# EAGLE design Voltage_Logger (EAGLE 6.4)
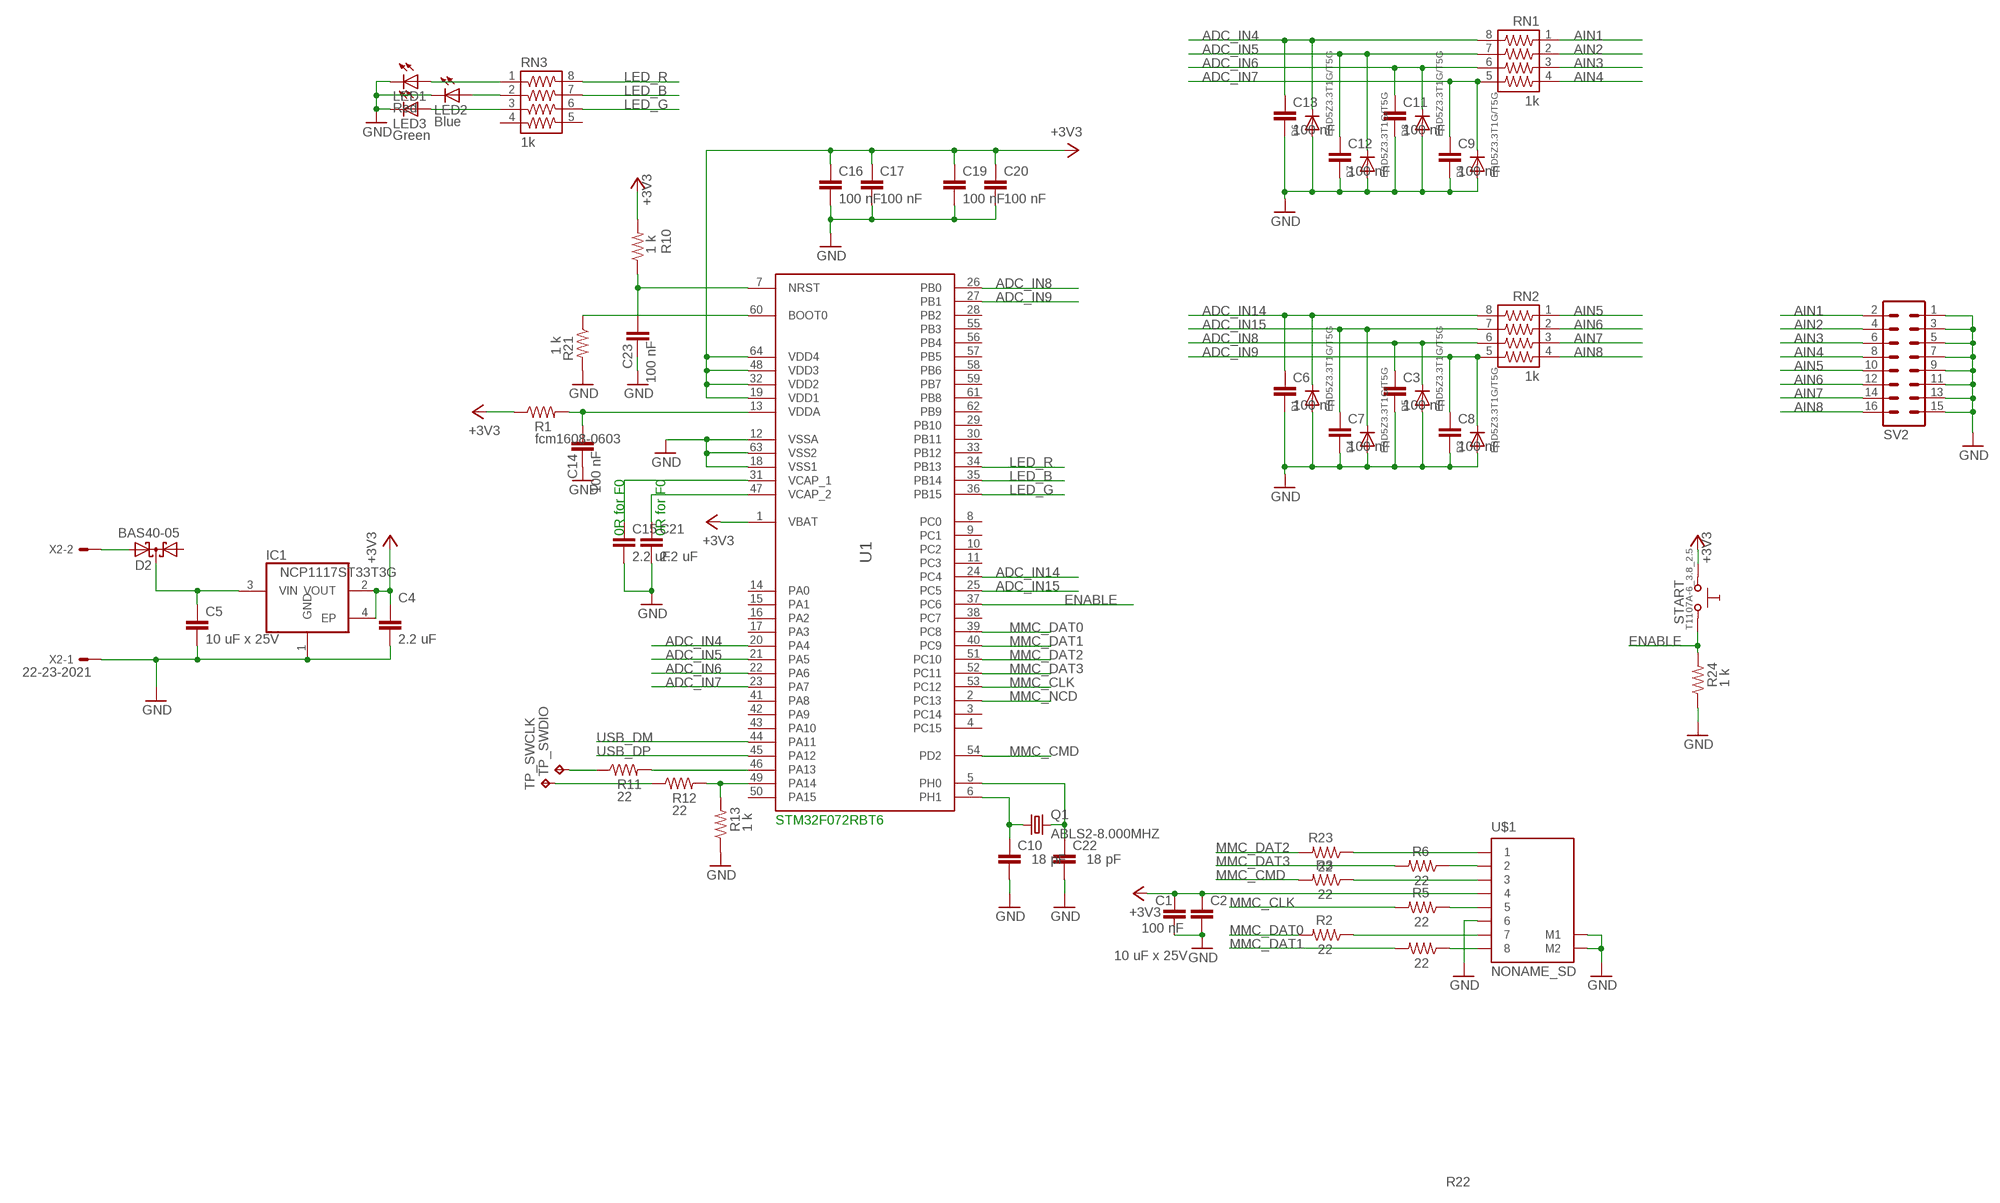
[diagram p0: schematic, sheet 1]

## Parts
C1  100 nF  C-EUC0603  [C0603]
C2  10 uF x 25V  C-EUC1206  [C1206]
C3  100 nF  C-EUC0603  [C0603]
C4  2.2 uF  C-EUC0603  [C0603]
C5  10 uF x 25V  C-EUC1206  [C1206]
C6  100 nF  C-EUC0603  [C0603]
C7  100 nF  C-EUC0603  [C0603]
C8  100 nF  C-EUC0603  [C0603]
C9  100 nF  C-EUC0603  [C0603]
C10  18 pF  C-EUC0603  [C0603]
C11  100 nF  C-EUC0603  [C0603]
C12  100 nF  C-EUC0603  [C0603]
C13  100 nF  C-EUC0603  [C0603]
C14  100 nF  C-EUC0603  [C0603]
C15  2.2 uF  C-EUC0603  [C0603]
C16  100 nF  C-EUC0603  [C0603]
C17  100 nF  C-EUC0603  [C0603]
C19  100 nF  C-EUC0603  [C0603]
C20  100 nF  C-EUC0603  [C0603]
C21  2.2 uF  C-EUC0603  [C0603]
C22  18 pF  C-EUC0603  [C0603]
C23  100 nF  C-EUC0603  [C0603]
D1  ESD5Z3.3T1G/T5G  DIODESOD-523  [SOD-523]
D2  BAS40-05  [SOT23]
D3  ESD5Z3.3T1G/T5G  DIODESOD-523  [SOD-523]
D4  ESD5Z3.3T1G/T5G  DIODESOD-523  [SOD-523]
D5  ESD5Z3.3T1G/T5G  DIODESOD-523  [SOD-523]
D6  ESD5Z3.3T1G/T5G  DIODESOD-523  [SOD-523]
D7  ESD5Z3.3T1G/T5G  DIODESOD-523  [SOD-523]
D8  ESD5Z3.3T1G/T5G  DIODESOD-523  [SOD-523]
D9  ESD5Z3.3T1G/T5G  DIODESOD-523  [SOD-523]
IC1  NCP1117ST33T3G  REG1117  [SOT223]
LED1  Red  LED_ESML0603  [LED_SML0603]
LED2  Blue  LED_ESML0603  [LED_SML0603]
LED3  Green  LED_ESML0603  [LED_SML0603]
Q1  ABLS2-8.000MHZ  CRYSTALSM49  [SM49]
R1  fcm1608-0603  R-US_R0603  [R0603]
R2  22  R-US_R0603  [R0603]
R3  22  R-US_R0603  [R0603]
R5  22  R-US_R0603  [R0603]
R6  22  R-US_R0603  [R0603]
R10  1 k  R-US_R0603  [R0603]
R11  22  R-US_R0603  [R0603]
R12  22  R-US_R0603  [R0603]
R13  1 k  R-US_R0603  [R0603]
R21  1 k  R-US_R0603  [R0603]
R22  22  R-US_R0603  [R0603]
R23  22  R-US_R0603  [R0603]
R24  1 k  R-US_R0603  [R0603]
RN1  1k  742-8NS  [742-8NS]
RN2  1k  742-8NS  [742-8NS]
RN3  1k  742-8NS  [742-8NS]
START  T1107A-6_3.8_2.5  SW-TAKT6  [SW-TAKT_6X3.5_SMD]
SV2  MA08-2  [MA08-2]
TP_SWCLK  TPTP10SQ  [TP10SQ]
TP_SWDIO  TPTP10SQ  [TP10SQ]
U1  STM32F405RGT6  STM32F405XXSTM32F405XX  [LQFP64]
U$1  NONAME_SD  [NONAME_SD]
X2  22-23-2021  [22-23-2021]

## Nets
+3V3: C1.1 C2.1 C4.1 C16.1 C17.1 C19.1 C20.1 IC1.2(VOUT) IC1.4(EP) R1.1 R10.2 START.P$1 U1.1(VBAT) U1.19(VDD1) U1.32(VDD2) U1.48(VDD3) U1.64(VDD4) U$1.4
ADC_IN4: C13.1 D6.K(C) RN1.8 U1.20(PA4)
ADC_IN5: C12.1 D7.K(C) RN1.7 U1.21(PA5)
ADC_IN6: C11.1 D8.K(C) RN1.6 U1.22(PA6)
ADC_IN7: C9.1 D9.K(C) RN1.5 U1.23(PA7)
ADC_IN8: C3.1 D5.K(C) RN2.6 U1.26(PB0)
ADC_IN9: C8.1 D3.K(C) RN2.5 U1.27(PB1)
ADC_IN14: C6.1 D1.K(C) RN2.8 U1.24(PC4)
ADC_IN15: C7.1 D4.K(C) RN2.7 U1.25(PC5)
AIN1: RN1.1 SV2.2
AIN2: RN1.2 SV2.4
AIN3: RN1.3 SV2.6
AIN4: RN1.4 SV2.8
AIN5: RN2.1 SV2.10
AIN6: RN2.2 SV2.12
AIN7: RN2.3 SV2.14
AIN8: RN2.4 SV2.16
ENABLE: R24.2 START.P$2 U1.37(PC6)
GND: C1.2 C2.2 C3.2 C4.2 C5.2 C6.2 C7.2 C8.2 C9.2 C10.2 C11.2 C12.2 C13.2 C14.2 C15.2 C16.2 C17.2 C19.2 C20.2 C21.2 C22.2 C23.2 D1.A D3.A D4.A D5.A D6.A D7.A D8.A D9.A IC1.1(GND) LED1.C LED2.C LED3.C R13.1 R21.2 R24.1 SV2.1 SV2.3 SV2.5 SV2.7 SV2.9 SV2.11 SV2.13 SV2.15 U1.12(VSSA) U1.18(VSS1) U1.63(VSS2) U$1.6 U$1.M1 U$1.M2 X2.1
LED_B: RN3.7 U1.35(PB14)
LED_G: RN3.6 U1.36(PB15)
LED_R: RN3.8 U1.34(PB13)
MMC_CLK: R5.2 U1.53(PC12)
MMC_CMD: R3.2 U1.54(PD2)
MMC_DAT0: R2.2 U1.39(PC8)
MMC_DAT1: R22.2 U1.40(PC9)
MMC_DAT2: R23.2 U1.51(PC10)
MMC_DAT3: R6.2 U1.52(PC11)
MMC_NCD: U1.2(PC13)
N$1: C15.1 U1.31(VCAP_1)
N$2: D2.2(A2) X2.2
N$3: C14.1 R1.2 U1.13(VDDA)
N$4: R3.1 U$1.3
N$5: R2.1 U$1.7
N$6: R5.1 U$1.5
N$7: LED2.A RN3.2
N$9: C5.1 D2.3(C) IC1.3(VIN)
N$11: R6.1 U$1.2
N$16: LED1.A RN3.1
N$18: LED3.A RN3.3
N$19: R22.1 U$1.8
N$20: R23.1 U$1.1
N$21: R11.2 U1.46(PA13)
N$22: R12.2 R13.2 U1.49(PA14)
N$23: C21.1 U1.47(VCAP_2)
N$24: R11.1 TP_SWDIO.TP
N$25: R12.1 TP_SWCLK.TP
N$27: C23.1 R10.1 U1.7(NRST)
N$28: R21.1 U1.60(BOOT0)
N$34: C22.1 Q1.2 U1.5(PH0)
N$35: C10.1 Q1.1 U1.6(PH1)
USB_DM: U1.44(PA11)
USB_DP: U1.45(PA12)
Unconnected: D2.1(A1) RN3.4 RN3.5 U1.3(PC14) U1.4(PC15) U1.8(PC0) U1.9(PC1) U1.10(PC2) U1.11(PC3) U1.14(PA0) U1.15(PA1) U1.16(PA2) U1.17(PA3) U1.28(PB2) U1.29(PB10) U1.30(PB11) U1.33(PB12) U1.38(PC7) U1.41(PA8) U1.42(PA9) U1.43(PA10) U1.50(PA15) U1.55(PB3) U1.56(PB4) U1.57(PB5) U1.58(PB6) U1.59(PB7) U1.61(PB8) U1.62(PB9)

## Notes on the sheet
- 0R for F0 | 0R for F0
- STM32F072RBT6

## Library data of the parts
C1-C17 C19-C23 = rcl:C-EU: CAPACITOR, European symbol
D1 D3-D9 = microbuilder:DIODE: Diode SMA Model Volts Amps Type Vf Vr Digikey # Notes SSA34-E3 40V 3A Schottky 480mV @ 3A 200uA @ 40V SSA34-E3/61TGITR-ND CDBA120-G 20V 1A Schottky 500mV @ 1A 500uA @ 20V 641-1014-6-ND REEL MBRA210 10V 2A Schottky 350mV @ 2A 700uA @ 10V MBRA210LT3 SOD-123 Model Volts Amps Type Vf Vr Order # Notes BAT54T1G 30V 200mA Schottky 800mV @ 200mA 2uA @ 25V BAT54T1GOSTR-ND B0530W 30V 500mA Schottky 430mV @ 500mA 130uA @ 30V B0530W-FDICT-ND REEL MBR120 1A 20V Schottky 340mV @ 1A MBR120VLSFT1GOSCT-ND SOD-323 Model Volts Amps Type Vf Vr Order # Notes PMEG2005EJ 20V 500mA Schottky 355mV @ 500mA 568-4110-1-ND ZLLS410 10V 570mA Schottky 380mV @ 570mA ZLLS410CT-ND 1N4148WS 75V 150mA Silicon/Simple 1V 1N4148WSFSCT-ND REEL SOD-523 Model Volts Amps Type Vf Vr Order # Notes BAT54XV2 30V 200mA Schottky 0.8V @ 100mA BAT54XV2CT-ND TB751S 30V 30mA Schottky RB751S-40TE61CT-ND SOT23-R/W (R = Solder Paste/Reflow Ovens, W = Hand-Soldering) Model Volts Amps Type Vf Vr Order # Notes BAT54FILM 40V 300mA Schottky 497-7162-1-ND
D2 = diode:BAS40-05: Silicon Schottky Diodes General-purpose diode for high-speed switching
IC1 = burr-brown:REG1117: 800mA and 1A Low Dropout (LDO) Positive Regulator 1.8V, 2.5V, 2.85V, 3.3V, 5V, and Adj; MPN: REG1117; OC_FARNELL: 1097566; OC_NEWARK: 14P6981
LED1-LED3 = eagle-ltspice:LED_E: LED Source: http://www.osram.convergy.de Source: www.luxeon.com Source: www.kingbright.com; SPICEMODEL: NONE; SPICEPREFIX: D; SPICETYPE: diode
Q1 = adafruit:CRYSTAL: CRYSTAL; OC_FARNELL: unknown; OC_NEWARK: unknown
R1-R3 R5 R6 R10-R13 R21-R24 = resistor:R-US_: RESISTOR, American symbol
RN1-RN3 = resistor-array:742-8: CTS 742 Series 8 Terminations, 4 Resistors
START = gogo:SW-TAKT
SV2 = con-lstb:MA08-2: PIN HEADER; OC_FARNELL: unknown; OC_NEWARK: unknown
TP_SWCLK TP_SWDIO = testpad:TP: Test pad
U1 = stm32f:STM32F405XX: Features • Core: ARM 32-bit Cortex™-M4 CPU with FPU, Adaptive real-time accelerator (ART Accelerator™) allowing 0-wait state execution from Flash memory, frequency up to 168 MHz, memory protection unit, 210 DMIPS/ 1.25 DMIPS/MHz (Dhrystone 2.1), and DSP instructions • Memories – Up to 1 Mbyte of Flash memory – Up to 192+4 Kbytes of SRAM including 64- Kbyte of CCM (core coupled memory) data RAM – Flexible static memory controller supporting Compact Flash, SRAM, PSRAM, NOR and NAND memories • LCD parallel interface, 8080/6800 modes • Clock, reset and supply management – 1.8 V to 3.6 V application supply and I/Os – POR, PDR, PVD and BOR – 4-to-26 MHz crystal oscillator – Internal 16 MHz factory-trimmed RC (1% accuracy) – 32 kHz oscillator for RTC with calibration – Internal 32 kHz RC with calibration • Low power – Sleep, Stop and Standby modes – VBAT supply for RTC, 20×32 bit backup registers + optional 4 KB backup SRAM • 3×12-bit, 2.4 MSPS A/D converters: up to 24 channels and 7.2 MSPS in triple interleaved mode • 2×12-bit D/A converters • General-purpose DMA: 16-stream DMA controller with FIFOs and burst support • Up to 17 timers: up to twelve 16-bit and two 32- bit timers up to 168 MHz, each with up to 4 IC/OC/PWM or pulse counter and quadrature (incremental) encoder input • Debug mode – Serial wire debug (SWD) & JTAG interfaces – Cortex-M4 Embedded Trace Macrocell™ • Up to 140 I/O ports with interrupt capability – Up to 136 fast I/Os up to 84 MHz – Up to 138 5 V-tolerant I/Os • Up to 15 communication interfaces – Up to 3 × I2C interfaces (SMBus/PMBus) – Up to 4 USARTs/2 UARTs (10.5 Mbit/s, ISO 7816 interface, LIN, IrDA, modem control) – Up to 3 SPIs (42 Mbits/s), 2 with muxed full-duplex I2S to achieve audio class accuracy via internal audio PLL or external clock – 2 × CAN interfaces (2.0B Active) – SDIO interface • Advanced connectivity – USB 2.0 full-speed device/host/OTG controller with on-chip PHY – USB 2.0 high-speed/full-speed device/host/OTG controller with dedicated DMA, on-chip full-speed PHY and ULPI – 10/100 Ethernet MAC with dedicated DMA: supports IEEE 1588v2 hardware, MII/RMII • 8- to 14-bit parallel camera interface up to 54 Mbytes/s • True random number generator • CRC calculation unit • 96-bit unique ID • RTC: subsecond accuracy, hardware calendar
U$1 = uSD:NONAME_SD
X2 = con-molex:22-23-2021: .100" (2.54mm) Center Header - 2 Pin; MF: MOLEX; MPN: 22-23-2021; OC_FARNELL: 1462926; OC_NEWARK: 25C3832

## Net classes
1 PWR: width 0.203 mm, drill 0.4 mm, clearance 0.076 mm

## Board
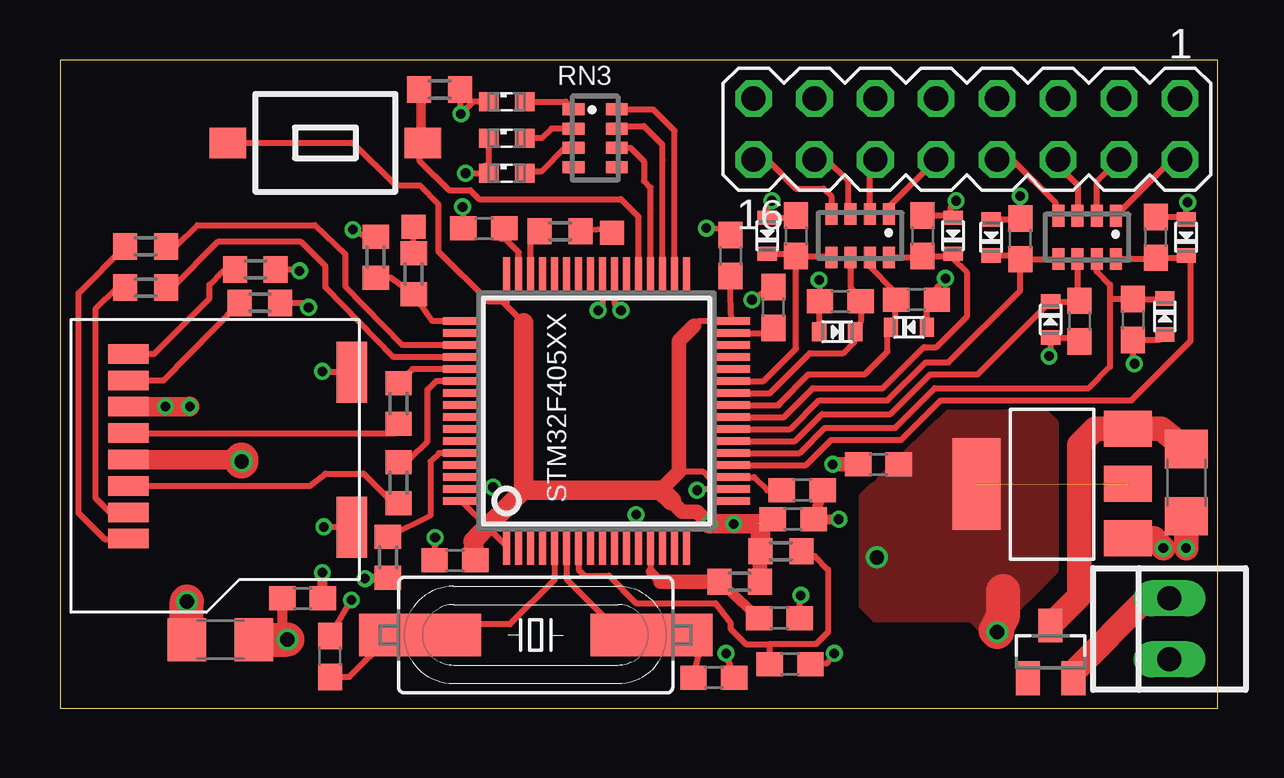
[diagram p1: board, top side]
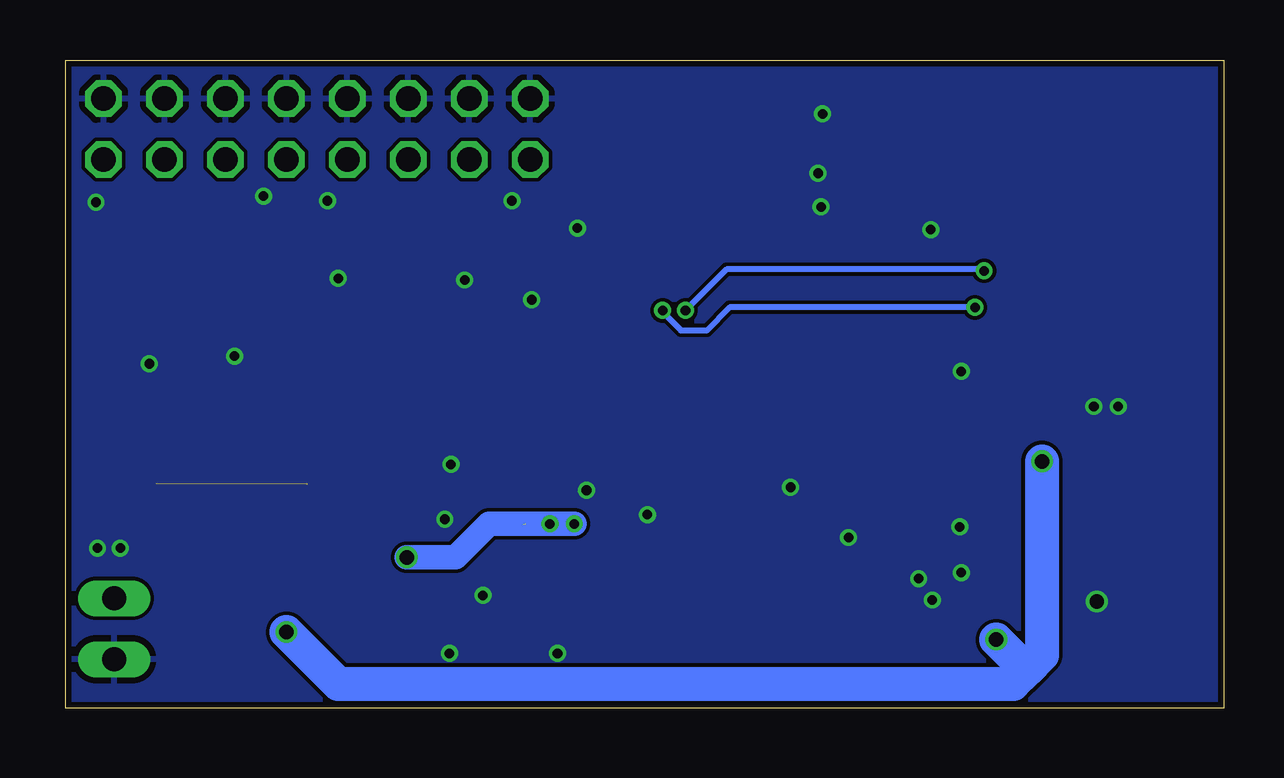
[diagram p2: board, bottom side, seen from below]

Size 48.26 x 27.01 mm. Coordinates in mm from the lower left corner, seen from the top.
Outline: 0,0 48.26,0 48.26,27.01 0,27.01 0,0
Copper layers (1*16): Top 0.035mm / dielectric 1.5mm / Bottom 0.035mm
Design rules "dirt_cheap_dirty_boards.v1 *": minimum track width 5mil, minimum drill 12mil, track to track 6mil, track to pad 6mil, pad to pad 6mil, via to via 6mil, smd to smd 1mil, copper to edge 10mil, drill to drill 10mil, minimum pad ring 10mil, minimum via ring 6mil, stop-mask expansion 2mil, vias tented up to drill 25mil, thermal gap 10mil

### Footprints (pad centres in the part's own frame; a part is rotated, then mirrored left to right if it is on the bottom)
C0603 = smd 1.1 x 1: 1 -0.85,0; 2 0.85,0
C1206 = smd 1.6 x 1.8: 1 -1.4,0; 2 1.4,0
SOD-523 = smd 0.8 x 0.6: A 0,-0.75; K 0,0.75
SOT23 = smd 1 x 1.4: 1 -0.95,-1.1; 2 0.95,-1.1; 3 0,1.1
SOT223 = smd 1.499 x 2.007: 1 -2.261,-3.15; 2 0.025,-3.15; 3 2.311,-3.15 | smd 3.81 x 2.007: 4 0,3.15
LED_SML0603 = smd 0.8 x 0.8: A 0.75,0; C -0.75,0
SM49 = smd 5.08 x 1.778: 1 -4.826,0; 2 4.826,0
R0603 = smd 1 x 1.1: 1 -0.85,0; 2 0.85,0
742-8NS = smd 0.5 x 0.9: 1 -1.2,-0.9; 2 -0.4,-0.9; 3 0.4,-0.9; 4 1.2,-0.9; 5 1.2,0.9; 6 0.4,0.9; 7 -0.4,0.9; 8 -1.2,0.9
SW-TAKT_6X3.5_SMD = smd 1.27 x 1.524: P$1 0,4.064; P$2 0,-4.064
MA08-2 = drill 1.016 octagon: 1 -8.89,-1.27; 2 -8.89,1.27; 3 -6.35,-1.27; 4 -6.35,1.27; 5 -3.81,-1.27; 6 -3.81,1.27; 7 -1.27,-1.27; 8 -1.27,1.27; 9 1.27,-1.27; 10 1.27,1.27; 11 3.81,-1.27; 12 3.81,1.27; 13 6.35,-1.27; 14 6.35,1.27; 15 8.89,-1.27; 16 8.89,1.27
TP10SQ = smd 1 x 1: TP 0,0
LQFP64 = smd 1.6 x 0.3: 1 -5.6,3.75; 2 -5.6,3.25; 3 -5.6,2.75; 4 -5.6,2.25; 5 -5.6,1.75; 6 -5.6,1.25; 7 -5.6,0.75; 8 -5.6,0.25; 9 -5.6,-0.25; 10 -5.6,-0.75; 11 -5.6,-1.25; 12 -5.6,-1.75; 13 -5.6,-2.25; 14 -5.6,-2.75; 15 -5.6,-3.25; 16 -5.6,-3.75; 33 5.6,-3.75; 34 5.6,-3.25; 35 5.6,-2.75; 36 5.6,-2.25; 37 5.6,-1.75; 38 5.6,-1.25; 39 5.6,-0.75; 40 5.6,-0.25; 41 5.6,0.25; 42 5.6,0.75; 43 5.6,1.25; 44 5.6,1.75; 45 5.6,2.25; 46 5.6,2.75; 47 5.6,3.25; 48 5.6,3.75 | smd 0.3 x 1.6: 17 -3.75,-5.6; 18 -3.25,-5.6; 19 -2.75,-5.6; 20 -2.25,-5.6; 21 -1.75,-5.6; 22 -1.25,-5.6; 23 -0.75,-5.6; 24 -0.25,-5.6; 25 0.25,-5.6; 26 0.75,-5.6; 27 1.25,-5.6; 28 1.75,-5.6; 29 2.25,-5.6; 30 2.75,-5.6; 31 3.25,-5.6; 32 3.75,-5.6; 49 3.75,5.6; 50 3.25,5.6; 51 2.75,5.6; 52 2.25,5.6; 53 1.75,5.6; 54 1.25,5.6; 55 0.75,5.6; 56 0.25,5.6; 57 -0.25,5.6; 58 -0.75,5.6; 59 -1.25,5.6; 60 -1.75,5.6; 61 -2.25,5.6; 62 -2.75,5.6; 63 -3.25,5.6; 64 -3.75,5.6
NONAME_SD = smd 1.676 x 0.813: 1 9.61,9.13; 2 9.61,8.03; 3 9.61,6.93; 4 9.61,5.83; 5 9.61,4.73; 6 9.61,3.63; 7 9.61,2.53; 8 9.61,1.43 | smd 1.27 x 2.54: M1 0.3,8.65; M2 0.3,2.2
22-23-2021 = drill 1 long: 1 -1.27,0; 2 1.27,0

### Placement (x,y rotation side)
C1  10.11,4.57 0 top
C2  6.68,2.86 180 top
C3  32.53,16.95 180 top
C4  34.12,10.16 180 top
C5  46.94,9.4 270 top
C6  35.96,19.68 90 top
C7  35.7,17.02 0 top
C8  30.69,19.68 90 top
C9  40.02,19.56 90 top
C10  27.26,1.27 0 top
C11  42.5,16.13 270 top
C12  44.72,16.19 270 top
C13  45.67,19.62 90 top
C14  29.99,3.75 0 top
C15  29.73,16.7 90 top
C16  27.96,18.86 90 top
C17  30.94,9.08 0 top
C19  30.56,7.87 0 top
C20  16.46,6.16 180 top
C21  17.67,20 180 top
C22  11.26,2.16 90 top
C23  30.43,1.84 0 top
D1  37.23,19.68 180 top
D2  41.29,2.35 0 top
D3  29.48,19.68 180 top
D4  35.39,15.88 90 top
D5  32.4,15.68 270 top
D6  46.94,19.62 180 top
D7  46.05,16.32 0 top
D8  41.29,16.19 0 top
D9  38.81,19.62 180 top
IC1  41.35,9.33 90 top
LED1  18.62,25.27 0 top
LED2  18.62,23.75 0 top
LED3  18.62,22.29 0 top
Q1  19.83,3.05 180 top
R1  28.34,5.27 180 top
R2  8.33,16.89 0 top
R3  14.11,9.4 90 top
R5  14.11,12.7 90 top
R6  3.57,17.53 0 top
R10  30.05,6.54 180 top
R11  20.84,19.88 180 top
R12  14.75,18.1 270 top
R13  13.16,18.8 270 top
R21  13.67,6.29 270 top
R22  8.14,18.29 0 top
R23  3.57,19.24 0 top
R24  15.83,25.78 180 top
RN1  42.81,19.62 180 top
RN2  33.35,19.68 180 top
RN3  22.3,23.75 270 top
START  11.06,23.56 90 top
SV2  37.8,24.13 180 top
TP_SWCLK  14.75,20.07 0 top
TP_SWDIO  23,19.81 0 top
U1  22.37,12.38 90 top
U$1  12.46,16.19 180 top
X2  46.24,3.3 90 top

### Tracks (layer width: path | path; a pad name or v marks a point on that pad's centre or on a via)
+3V3  (via drill 0.4, 0.6)  (2 unrouted)
  Top 0.254: U1.32 28,16.16 28.56,16.16 | U1.32 26.63,16.13 26.43,15.94 | 25.8,9.97 25.8,9.84 26.81,9.84 27.02,9.63 U1.19 28.93,9.63 29.48,9.08 C17.1 | U1.1 18.57,6.78 17.8,7.56 16.77,8.58 U1.64 | C16.1 27.93,17.18 U1.32 | U1.48 18.62,16.77 | 18.62,16.77 19.32,16.07 | 29.31,6.17 R10.2 29.19,6.53 | C19.1 29.29,7.87 29.1,7.68 | 29.2,7.66 29.23,7.68 | START.P$1 12.21,23.56 13.99,21.78 15,21.78 15.76,21.02 15.76,19.05 17.86,16.95 18.43,16.95 18.62,16.77
  Top 0.406: C1.1 9.26,3.07 v9.48,2.86
  Top 0.61: v27.07,7.68 26.56,8.19 25.92,8.19 25.48,8.64 | 25.8,9.84 25.04,9.08 | 26.43,15.94 25.8,15.3 25.8,9.97 | R1.1 29.19,6.53
  Top 0.813: 25.48,8.64 25.04,9.08 19.32,9.08 | 19.32,9.08 17.8,7.56 17.54,7.3 17.23,6.96 C20.1 | 19.32,9.08 19.32,16.07 | U$1.4 7.57,10.36 | v27.07,7.68 v28.08,7.68 29.1,7.68 | R10.2 29.2,7.66
  Top 1.422: v39.07,3.17 39.01,3.24 39.32,3.87 39.32,4.89 | v7.57,10.29 7.57,10.36 | C2.1 v9.48,2.86
  Bottom 1.016: v27.07,7.68 30.62,7.68 32.02,6.29 v34.05,6.29
  Bottom 1.422: v39.07,3.17 36.91,1.02 8.78,1.02 8.21,1.59 | v7.57,10.29 7.57,2.22 8.21,1.59 | v9.48,2.86 8.21,1.59
  pour Top (isolate 0.254, no thermals): 41.48,11.94 41.48,5.71 39.01,3.24 38.43,3.24 37.99,3.68 33.99,3.68 33.42,4.25 33.42,8.83 36.15,11.49 37.1,12.38 41.1,12.32
ADC_IN4
  Top 0.254: U1.20 31.1,10.13 32.15,11.18 35.07,11.18 36.72,12.83 44.66,12.83 47.13,15.3 47.13,18.68 D6.K 46.84,18.77 C13.1 45.62,18.72 RN1.8
ADC_IN5
  Top 0.254: RN1.7 43.22,18.21 43.77,17.65 43.77,16.95 | D7.K 46.03,17.04 C12.1 43.86,17.04 43.77,16.95 | U1.21 30.84,10.63 31.89,11.68 34.81,11.68 36.47,13.34 42.88,13.34 43.77,14.22 43.77,16.95
ADC_IN6
  Top 0.254: RN1.6 42.41,17.06 C11.1 42.46,16.94 D8.K 38.26,13.91 36.27,13.91 34.62,12.26 31.77,12.26 30.64,11.13 U1.22
ADC_IN7
  Top 0.254: U1.23 30.45,11.63 31.64,12.83 34.5,12.83 36.08,14.41 37.04,14.41 40.02,17.4 C9.1 | 39.77,18.45 C9.1 | D9.K 39.86,18.87 C9.1 | C9.1 41.6,18.71 RN1.5
ADC_IN8
  Top 0.254: U1.26 29.6,13.13 31.26,14.8 32.66,14.8 33.1,15.24 33.1,15.82 D5.K 33.38,16.1 C3.1 32.95,17.57 RN2.6
ADC_IN9
  Top 0.254: U1.27 29.33,13.63 30.69,14.99 C8.1 | C8.1 32.1,18.84 RN2.5 | D3.K 30.59,18.93 C8.1 | 30.81,18.71 C8.1
ADC_IN14
  Top 0.254: RN2.8 35.91,18.78 C6.1 37.13,18.84 D1.K 37.23,18.73 37.8,18.16 37.8,16.32 36.53,15.05 36.02,15.05 34.31,13.34 31.39,13.34 30.18,12.13 U1.24
ADC_IN15
  Top 0.254: U1.25 29.98,12.63 29.98,12.7 31.2,13.91 33.54,13.91 34.5,14.86 34.5,15.86 D4.K 34.79,16.03 C7.1 34.79,17.36 33.75,18.4 RN2.7
AIN1
  Top 0.254: SV2.2 46.35,22.86 RN1.1
AIN2
  Top 0.254: RN1.2 43.22,21.93 SV2.4
AIN3
  Top 0.254: SV2.6 41.61,22.61 42.43,21.78 42.43,20.54 RN1.3
AIN4
  Top 0.254: SV2.8 39.7,22.86 41.48,21.08 41.48,20.66 RN1.4
AIN5
  Top 0.254: RN2.1 34.55,20.89 SV2.10
AIN6
  Top 0.254: RN2.2 33.75,22.62 SV2.12
AIN7
  Top 0.254: SV2.14 31.96,22.86 32.85,21.97 32.85,20.69 RN2.3
AIN8
  Top 0.254: SV2.16 29.48,22.86 30.69,21.65 31.83,21.65 32.15,21.34 RN2.4
ENABLE
  Top 0.254: START.P$2 15.13,25.63 R24.2 14.98,22.82 16.21,21.59 17.1,21.59 17.48,21.21 23.38,21.21 24.12,20.48 U1.37
GND  (via drill 0.4, 0.6)
  Top 0.254: U1.18 26.61,9.13 v26.56,9.08 | U1.12 24.12,8.09 v24.02,8.06 | U1.63 18,9.13 v18.05,9.21 | C22.2 v12.14,4.51 | C20.2 15.66,6.96 v15.64,7.11 | C10.2 v27.77,2.29 | 31.41,7.9 v32.46,7.87 | R13.1 12.69,19.65 v12.21,19.94 | C15.2 29.93,17.72 v28.85,17.02 | C16.2 27.73,19.96 v26.94,20 | LED2.C LED3.C | C21.2 16.82,20.93 v16.78,20.89 | v16.91,22.29 18.05,22.3 LED3.C | 17.73,22.62 LED3.C | U$1.M1 11.02,7.54 v11,7.56 | U$1.M2 10.98,13.99 v10.94,14.03 | D5.A 31.65,17.12 C3.2 31.68,17.74 v31.64,17.84 | D4.A 36.13,16.79 C7.2 36.55,17.55 v36.91,17.91 | C6.2 37.13,20.53 | 37.13,20.53 D1.A | C8.2 30.59,20.43 D3.A 29.48,20.95 v29.67,21.15 | 37.13,20.53 37.13,20.85 v37.35,21.15 | v40.02,21.34 C9.2 39.98,20.37 D9.A | v41.23,14.67 41.29,14.73 D8.A 42.33,15.44 C11.2 | v44.78,14.35 44.72,14.41 C12.2 45.83,15.34 D7.A | C13.2 46.84,20.47 D6.A 46.94,21.02 v47.01,21.08 | C23.2 31.98,1.88 v32.27,2.29 | R24.1 16.68,24.8 v16.72,24.76 17.23,25.27 LED1.C | C14.2 30.84,4.66 v30.88,4.7
  Top 0.406: C19.2 v32.46,7.87 | C17.2 31.41,7.9 | C1.2 10.94,4.64 v10.94,5.65 | R21.2 v12.72,5.4
  Top 0.61: C4.2 v32.21,10.16
  Top 0.813: U$1.6 5.4,12.56 v5.41,12.57
  Top 1.016: C5.2 v46.94,6.67 | IC1.1 45.58,7.07 v45.99,6.67
  Top 1.422: C2.2 v5.29,4.44
  other vias: 4.4,12.57
  pour Bottom: 0.14,0.19 0.14,26.86 48.09,26.86 48.02,0.19
LED_B
  Top 0.254: U1.35 25.12,22.84 25.1,22.86 25.1,23.5 24.34,24.26 23.38,24.26 23.28,24.15 RN3.7
LED_G
  Top 0.254: U1.36 24.62,21.69 24.34,21.97 24.34,22.8 23.78,23.35 RN3.6
LED_R
  Top 0.254: U1.34 25.62,24.05 24.72,24.95 RN3.8
MMC_CLK
  Top 0.254: U1.53 14.69,14.13 R5.2
MMC_CMD
  Top 0.254: R3.2 14.65,10.44 15.32,11.11 15.32,13.27 15.68,13.63 U1.54
MMC_DAT0  (via drill 0.4)
  Top 0.254: U1.39 23.12,16.84 v23.38,16.57 | R2.2 10.18,16.89 v10.37,16.7
  Bottom 0.254: v10.37,16.7 20.59,16.7 21.54,15.75 22.62,15.75 23.38,16.51 v23.38,16.57
MMC_DAT1  (via drill 0.4)
  Top 0.254: U1.40 22.62,16.76 v22.43,16.57 | R22.2 9.86,18.29 9.92,18.22 v9.99,18.22
  Bottom 0.254: v22.43,16.57 20.72,18.29 10.05,18.29 v9.99,18.22
MMC_DAT2
  Top 0.254: U1.51 14.28,15.13 11.89,17.59 11.89,18.92 10.62,20.13 5.73,20.13 4.84,19.24 R23.2
MMC_DAT3
  Top 0.254: U1.52 13.89,14.63 11.06,17.53 11.06,18.42 10.05,19.43 6.58,19.43 4.68,17.53 R6.2
N$1
  Top 0.254: U1.31 29.67,15.63 C15.1
N$2
  Top 1.016: X2.2 45.31,4.57 42.24,1.5 D2.2
N$3
  Top 0.254: U1.13 24.62,5.69
  Top 0.406: 25.04,5.27 24.62,5.69 | R1.2 C14.1
  Top 0.61: R1.2 25.04,5.27
N$4
  Top 0.254: U$1.3 10.42,9.26 11.06,9.78 12.65,9.78 13.88,8.55 R3.1
N$5
  Top 0.254: U$1.7 4.32,13.66 R2.1
N$6
  Top 0.254: U$1.5 13.98,11.46 R5.1
N$7
  Top 0.254: RN3.2 20.48,24.15 20.08,23.75 LED2.A
N$9
  Top 1.016: D2.3 42.5,4.66 42.5,10.99 43.16,11.65 IC1.3 45.9,11.65 C5.1
N$11
  Top 0.254: R6.1 2.37,17.53 1.48,16.64 1.48,8.76 2.17,8.06 2.75,8.06 U$1.2
N$16
  Top 0.254: LED1.A 21.08,25.27 RN3.1
N$18
  Top 0.254: RN3.3 21.05,23.35 20.06,22.36 19.44,22.36 LED3.A
N$19
  Top 0.254: U$1.8 3.92,14.76 6.24,17.08 6.24,17.65 6.81,18.22 7.49,18.22 R22.1
N$20
  Top 0.254: 2.68,19.24 R23.1 0.78,17.3 0.78,8.13 1.86,7.05 2.84,7.05 U$1.1
N$21
  Top 0.254: U1.46 19.62,19.7 R11.2
N$22
  Top 0.254: U1.49 15.53,16.13 R12.2 13.79,17.95 R13.2
N$23
  Top 0.254: U1.47 19.12,19 18.56,19.56 18.39,19.56 C21.1
N$24
  Top 0.254: TP_SWDIO.TP 22.62,19.96 R11.1
N$25
  Top 0.254: R12.1 TP_SWCLK.TP
N$27
  Top 0.254: U1.7 21.62,5.77 21.86,5.52 22.88,5.52 24.02,4.38 27.32,4.38 27.96,3.56 27.96,3.3 28.59,2.67 29.58,2.67 | R10.1 30.81,6.35 31.45,6.35 32.02,5.78 32.02,3.17 31.51,2.67 29.58,2.67 | 29.67,1.8 C23.1 29.58,2.67
N$28
  Top 0.254: U1.60 15.79,10.63 15.45,10.29 15.45,8.03 R21.1
N$34
  Top 0.254: 17.42,2.92 Q1.2 | C22.1 12.06,1.31 13.67,2.92 15.51,2.92 Q1.2 | U1.5 20.62,5.36 18.75,3.49 16.08,3.49 Q1.2
N$35
  Top 0.254: U1.6 21.12,5.38 22.75,3.75 24.59,3.75 Q1.1 | 24.02,3.11 Q1.1 | C10.1 26.75,2.73 Q1.1